# Altium schematic sheet ActiTouch_Transmitter_Sheet1.SchDoc
size A4; SheetNumber: 2; SheetTotal: 5
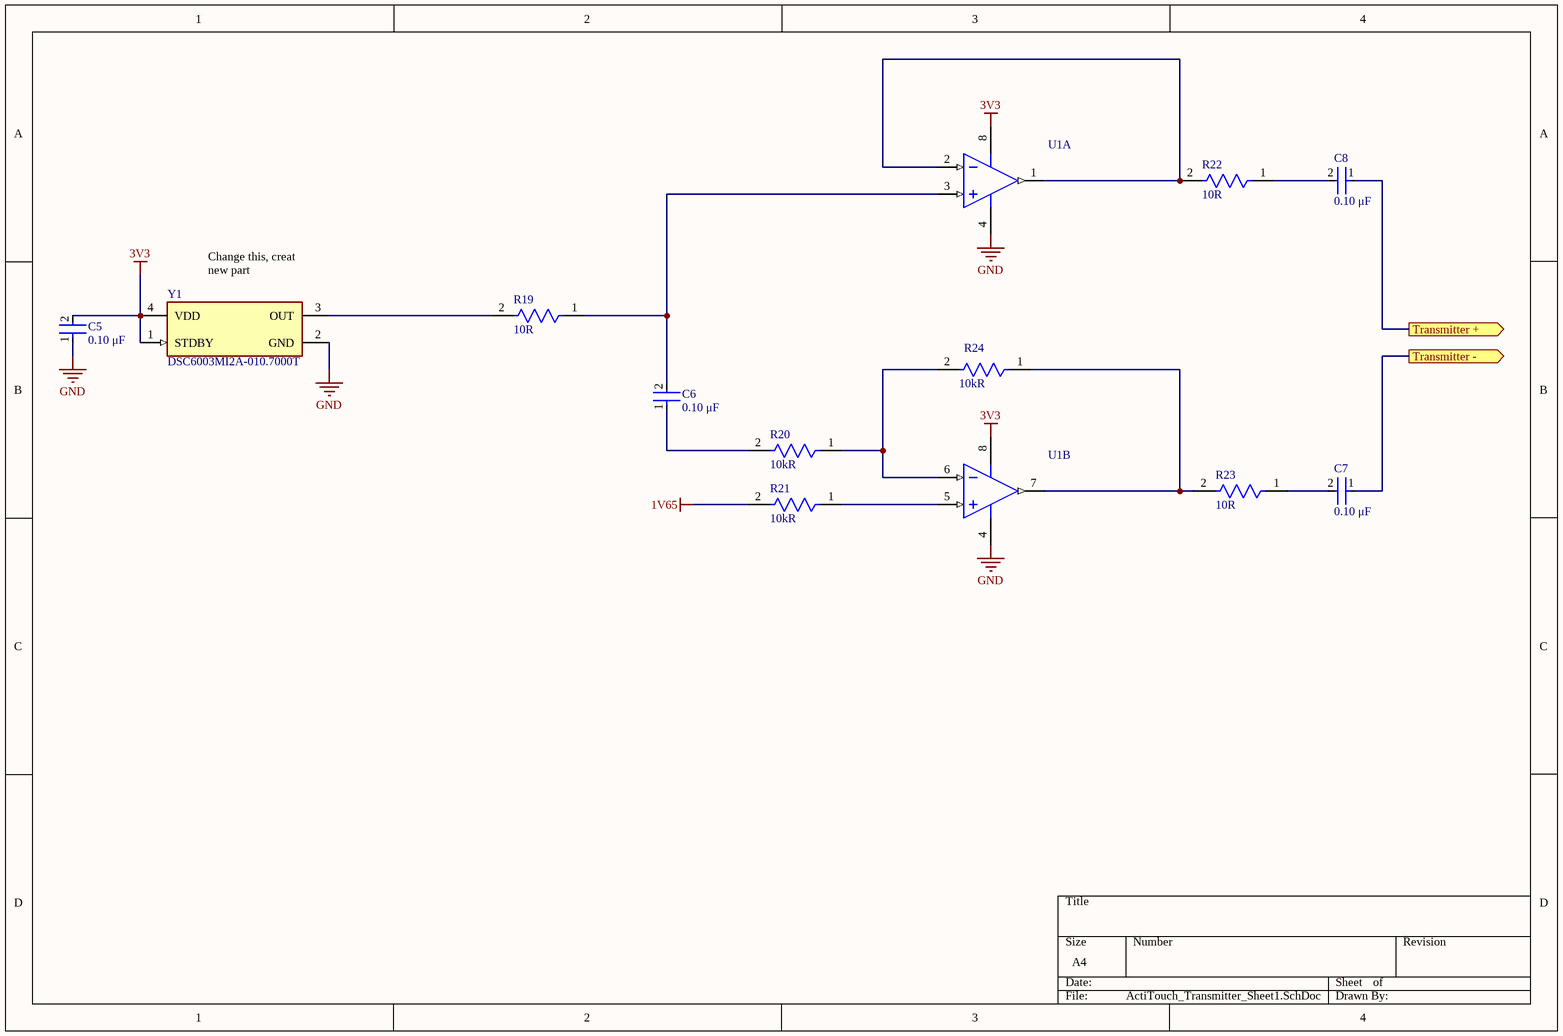
[diagram p0: ActiTouch_Transmitter_Sheet1.SchDoc]

## Parts
C5  value 0.10 μF  [FP-C0603C-CF-MFG]  (hidden comment: C0603C104K5RACTU)
C6  value 0.10 μF  [FP-C0603C-CF-MFG]  (hidden comment: C0603C104K5RACTU)
C7  value 0.10 μF  [FP-C0603C-CF-MFG]  (hidden comment: C0603C104K5RACTU)
C8  value 0.10 μF  [FP-C0603C-CF-MFG]  (hidden comment: C0603C104K5RACTU)
R19  Resistance: 10R  [FP-ESR03-MFG]  (hidden comment: ESR03EZPJ101)
R20  Resistance: 10kR  [FP-ESR03-MFG]  (hidden comment: ESR03EZPJ101)
R21  Resistance: 10kR  [FP-ESR03-MFG]  (hidden comment: ESR03EZPJ101)
R22  Resistance: 10R  [FP-ESR03-MFG]  (hidden comment: ESR03EZPJ101)
R23  Resistance: 10R  [FP-ESR03-MFG]  (hidden comment: ESR03EZPJ101)
R24  Resistance: 10kR  [FP-ESR03-MFG]  (hidden comment: ESR03EZPJ101)
U1  OPA2836IDR  [D0008A_M]  (value not drawn)  (parts A,B of 2)
Y1  DSC6003MI2A-010.7000T  [FP-C04-1202-MFG]

## Ports
Transmitter + (out), Transmitter - (out)

## Nets
1V65: R21.2
3V3: C5.2 U1.8(VS+) Y1.1(STDBY) Y1.4(VDD)
GND: C5.1 U1.4(VS-) Y1.2(GND)
Transmitter +: C8.1 ; port Transmitter +
Transmitter -: C7.1 ; port Transmitter -
NetC6_1: C6.1 R20.2
NetC6_2: C6.2 R19.1 U1.3(VIN1+)
NetC7_2: C7.2 R23.1
NetC8_2: C8.2 R22.1
NetR19_2: R19.2 Y1.3(OUT)
NetR20_1: R20.1 R24.2 U1.6(VIN2-)
NetR21_1: R21.1 U1.5(VIN2+)
NetR22_2: R22.2 U1.1(VOUT1) U1.2(VIN1-)
NetR23_2: R23.2 R24.1 U1.7(VOUT2)

## Notes on the sheet
- (near Y1) Change this, creat new part

## Library data of the parts
C5-C8 = CMP-2006-03061-2: CAP CER 0.1UF 50V X7R 0603; Manufacturer: KEMET; Tolerance: 0.1; Temperature Coefficient: 30ppm/°C; Material: Ceramic; Automotive Grade: Grade 1; Temperature: -55°C to +125°C; RoHS: TRUE; Temperature Range High: +125°C; Lead Free: Yes; Octopart: https://octopart.com/c0603c104k5ractu-kemet-139244; Digikey Description: CAP CER 0.1UF 50V X7R 0603; Category: Cap; Package: C0603C-CF; ComponentLink2Description: Datasheet; Temperature Range Low: -55°C; Device Class L1: Passive Components; Voltage Rating: 50 V; Automotive: Yes; Device Class L3: Ceramic Capacitors; ComponentLink2URL: https://api.kemet.com/component-edge/download/datasheet/C0603C100J5GACAUTO.pdf; Capacitance: 0.10 μF; Device Class L2: Capacitors; Manufacturer Part Number: C0603C104K5RACTU; Temperature Characteristic: X7R; Height: 0.87mm
R19-R24 = CMP-08839-000028-1: 100Ω ±5% 0.25W 0603 Anti-Surge Chip Resistor AEC-Q200; Power Rating: 200mW; Temperature Coefficient: 200ppm/°C; Max Power Dissipation: 250mW; Case Code (Imperial): 0603; Number of Terminations: 2; RoHS Compliant: Yes; Series: ESR; Lead Free: Lead Free; Features: Automotive AEC-Q200; Case/Package: 0603; Tolerance: 5%; Min Operating Temperature: -55°C; Size Code: 0603; Case Code (Metric): 1608; Max Operating Temperature: 155°C; Packaging: Tape and Reel
U1 = CMP-0018-00293-2: Dual, Very Low Power, Rail to Rail Out, Negative Rail In, VFB Operational Amplifier, 2.5 to 5.5 V, -40 to 85 degC, 8-pin SOIC (D8), Green (RoHS & no Sb/Br); Manufacturer: Texas Instruments; Settling Time (0.1%)(Typ)(ns): 30; Iib(Max)(nA): 1000; Vio(Max)(mV): 0.4; Vs(Min)(V): 2.5; Vs(Max)(V): 5.5; Io(Typ)(mA): 50; Sub Family: High Output Current Amplifier (>=50mA), High Speed Amplifier (>=50MHz), Low Noise Amp (<=10nV/rtHz), Low Offset Voltage Amplifier (<=500uV), Low Supply Voltage Amplifier (<=2.7V); Vn at Flatband(Typ)(nV/rtHz): 4.6; Slew Rate(Typ)(V/us): 560; Number of Channels: 2; Iq per channel(Max)(mA): 1; BW @ Acl(MHz): 205; 3rd Harmonic(dBc): 105; 2nd Harmonic(dBc): 85; Mounting Technology: Surface Mount; ComponentLink3URL: http://www.ti.com/litv/pdf/msoi002j; ComponentLink1URL: http://www.ti.com/; DatasheetVersion: SLOS712D; Code_JEDEC: MS-012; PackageDescription: 8-Pin Plastic Small Outline, Body 4.9 x 3.9 mm, Pitch 1.27 mm; ComponentLink3Description: Package Specification; Eco-Plan: Green (RoHS & no Sb/Br); PackageReference: D0008A; PackageVersion: 4040047-3/M, 06/2011; PartNumber: OPA2836IDR; ComponentLink2Description: Datasheet; Acl, min stable gain(V/V): 1; ComponentLink1Description: Manufacturer URL; ComponentLink2URL: http://www.ti.com/general/docs/lit/getliterature.tsp?genericPartNumber=OPA2836&fileType=pdf
Y1 = CMP-06255-000006-1: Max Supply Current: 1.3mA; Frequency Stability: 50ppm; Frequency: 24MHz; Case/Package: SMD/SMT; Packaging: Tape and Reel; Min Operating Temperature: -40°C; Ratings: AEC-Q100; Mount: Surface Mount; Max Operating Temperature: 85°C